# EAGLE design SidBerry_AriettaG25 (EAGLE 7.1.0)
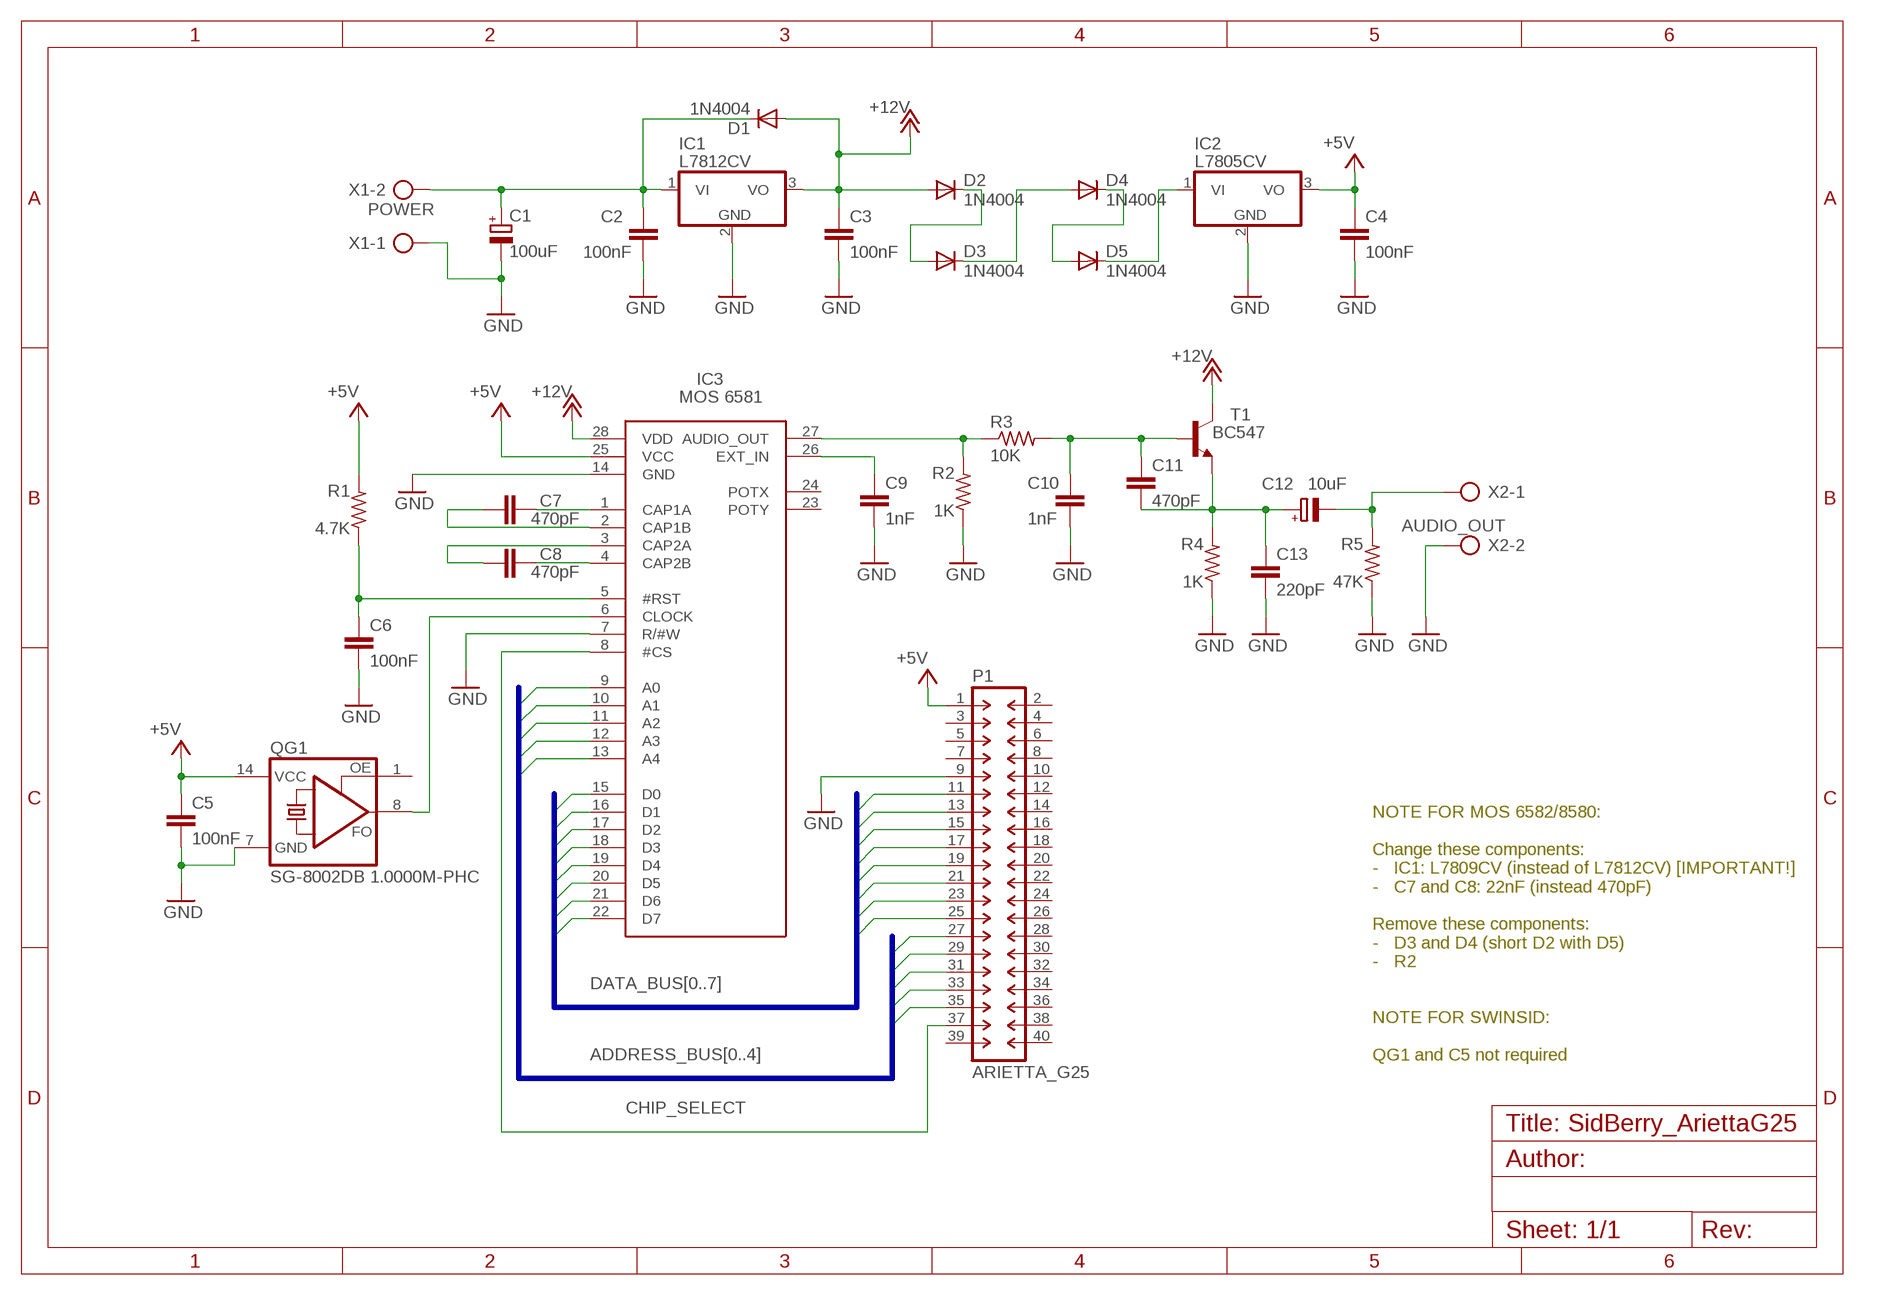
[diagram p0: schematic, sheet 1]
FRAME1 (A4L-LOC): AUTHOR: Alessio Lombardo; REV: 1

## Parts
C1  100uF  CPOL-EUE2.5-6  [E2,5-6]
C2  100nF  C-EU025-024X044  [C025-024X044]
C3  100nF  C-EU025-024X044  [C025-024X044]
C4  100nF  C-EU025-024X044  [C025-024X044]
C5  100nF  C-EU025-024X044  [C025-024X044]
C6  100nF  C-EU025-024X044  [C025-024X044]
C7  470pF  C-EU025-024X044  [C025-024X044]
C8  470pF  C-EU025-024X044  [C025-024X044]
C9  1nF  C-EU025-024X044  [C025-024X044]
C10  1nF  C-EU025-024X044  [C025-024X044]
C11  470pF  C-EU025-024X044  [C025-024X044]
C12  10uF  CPOL-EUE2.5-5  [E2,5-5]
C13  220pF  C-EU025-024X044  [C025-024X044]
D1  1N4004  [DO41-10]
D2  1N4004  [DO41-10]
D3  1N4004  [DO41-10]
D4  1N4004  [DO41-10]
D5  1N4004  [DO41-10]
IC1  L7812CV  7812TV  [TO220V]
IC2  L7805CV  7805TV  [TO220V]
IC3  MOS 6581  SID_6581  [DIL28-6]
P1  ARIETTA_G25  M-2X20-DIL-100  [DIL-100-2X20]
QG1  SG-8002DB 1.0000M-PHC  SG51  [SG51]
R1  4.7K  R-US_0207/10  [0207/10]
R2  1K  R-US_0207/10  [0207/10]
R3  10K  R-US_0207/10  [0207/10]
R4  1K  R-US_0207/10  [0207/10]
R5  47K  R-US_0207/10  [0207/10]
T1  BC547  BC547-NPN-TO92-CBE  [TO92-CBE]
X1  POWER  AK500/2  [AK500/2]
X2  AUDIO_OUT  AK500/2  [AK500/2]

## Nets
+5V: C4.1 C5.1 IC2.3(VO) IC3.25(VCC) P1.1 QG1.14(VCC) R1.2
+12V: C3.1 D1.A D2.A IC1.3(VO) IC3.28(VDD) T1.C
ADDRESS_BUS0: IC3.9(A0) P1.27
ADDRESS_BUS1: IC3.10(A1) P1.29
ADDRESS_BUS2: IC3.11(A2) P1.31
ADDRESS_BUS3: IC3.12(A3) P1.33
ADDRESS_BUS4: IC3.13(A4) P1.35
CHIP_SELECT: IC3.8(#CS) P1.37
DATA_BUS0: IC3.15(D0) P1.25
DATA_BUS1: IC3.16(D1) P1.23
DATA_BUS2: IC3.17(D2) P1.21
DATA_BUS3: IC3.18(D3) P1.19
DATA_BUS4: IC3.19(D4) P1.17
DATA_BUS5: IC3.20(D5) P1.15
DATA_BUS6: IC3.21(D6) P1.13
DATA_BUS7: IC3.22(D7) P1.11
GND: C1.- C2.2 C3.2 C4.2 C5.2 C6.2 C9.2 C10.2 C13.2 IC1.2(GND) IC2.2(GND) IC3.7(R/#W) IC3.14(GND) P1.9 QG1.7(GND) R2.1 R4.1 R5.1 X1.1 X2.2
N$1: IC3.6(CLOCK) QG1.8(FO)
N$2: C9.1 IC3.26(EXT_IN)
N$3: D2.C D3.A
N$4: D3.C D4.A
N$5: D4.C D5.A
N$6: D5.C IC2.1(VI)
N$7: C8.2 IC3.4(CAP2B)
N$8: C8.1 IC3.3(CAP2A)
N$9: C7.1 IC3.2(CAP1B)
N$10: C7.2 IC3.1(CAP1A)
N$11: C6.1 IC3.5(#RST) R1.1
N$12: IC3.27(AUDIO_OUT) R2.2 R3.1
N$13: C1.+ C2.1 D1.C IC1.1(VI) X1.2
N$14: C12.- R5.2 X2.1
N$15: C10.1 C11.1 R3.2 T1.B
N$16: C11.2 C12.+ C13.1 R4.2 T1.E
Unconnected: IC3.23(POTY) IC3.24(POTX) P1.2 P1.3 P1.4 P1.5 P1.6 P1.7 P1.8 P1.10 P1.12 P1.14 P1.16 P1.18 P1.20 P1.22 P1.24 P1.26 P1.28 P1.30 P1.32 P1.34 P1.36 P1.38 P1.39 P1.40 QG1.1(OE)

## Buses
ADDRESS_BUS[0..4]
DATA_BUS[0..7]

## Notes on the sheet
- NOTE FOR MOS 6582/8580:
  
  Change these components:
  -   IC1: L7809CV (instead of L7812CV) [IMPORTANT!]
  -   C7 and C8: 22nF (instead 470pF)
  
  Remove these components:
  -   D3 and D4 (short D2 with D5)
  -   R2
  
  
  NOTE FOR SWINSID:
  
  QG1 and C5 not required

## Library data of the parts
C1 C12 = rcl:CPOL-EU: POLARIZED CAPACITOR, European symbol
C2-C11 C13 = rcl:C-EU: CAPACITOR, European symbol
D1-D5 = _mod_diode:1N4004: DIODE general purpose rectifier, 1 A
IC1 IC2 = linear:78*: Positive VOLTAGE REGULATOR Source: http://cache.national.com/ds/LM/LM78L05.pdf http://www.fairchildsemi.com/ds/LM/LM7805.pdf
IC3 = 6581-sid:SID_6581
P1 = con-headers-jp:M-2X20-: MALE HEADER
QG1 = crystal:SG51: CRYSTAL RESONATOR; OC_FARNELL: unknown; OC_NEWARK: unknown
R1-R5 = rcl:R-US_: RESISTOR, American symbol
T1 = transistor:*-NPN-: NPN Transistror BF959 corrected 2008.03.06
X1 X2 = con-ptr500:AK500/2: CONNECTOR; OC_FARNELL: unknown; OC_NEWARK: unknown

## Board
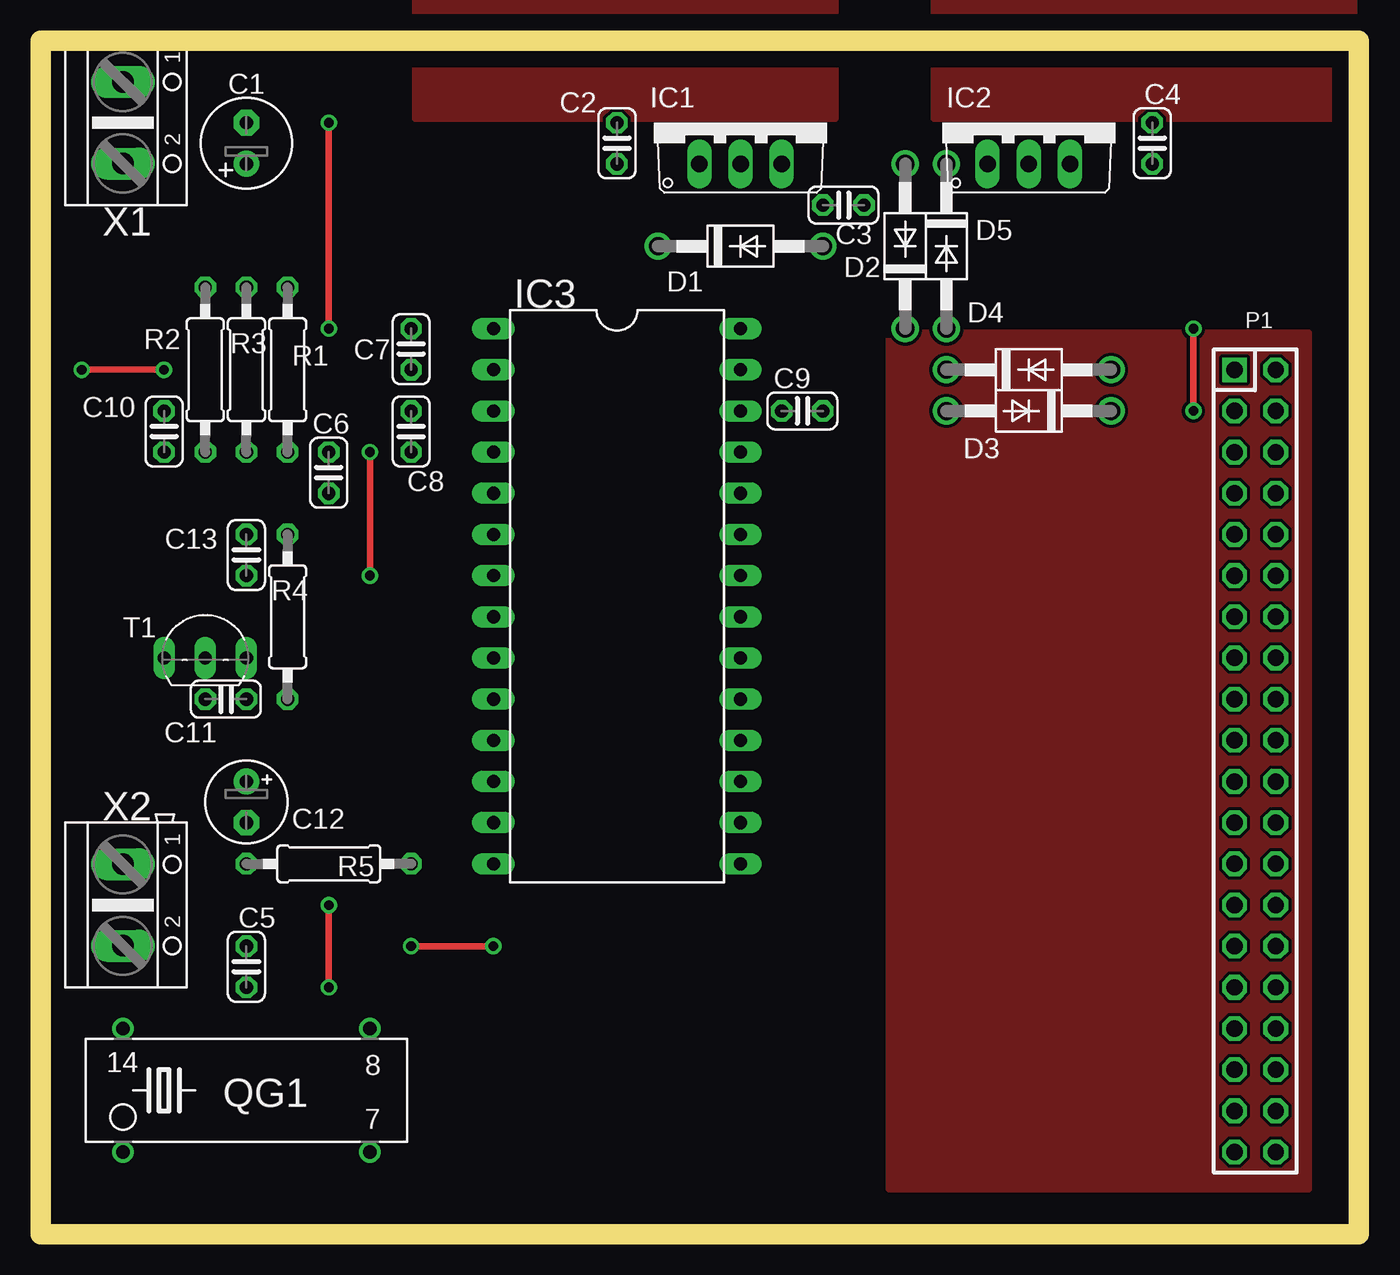
[diagram p1: board, top side]
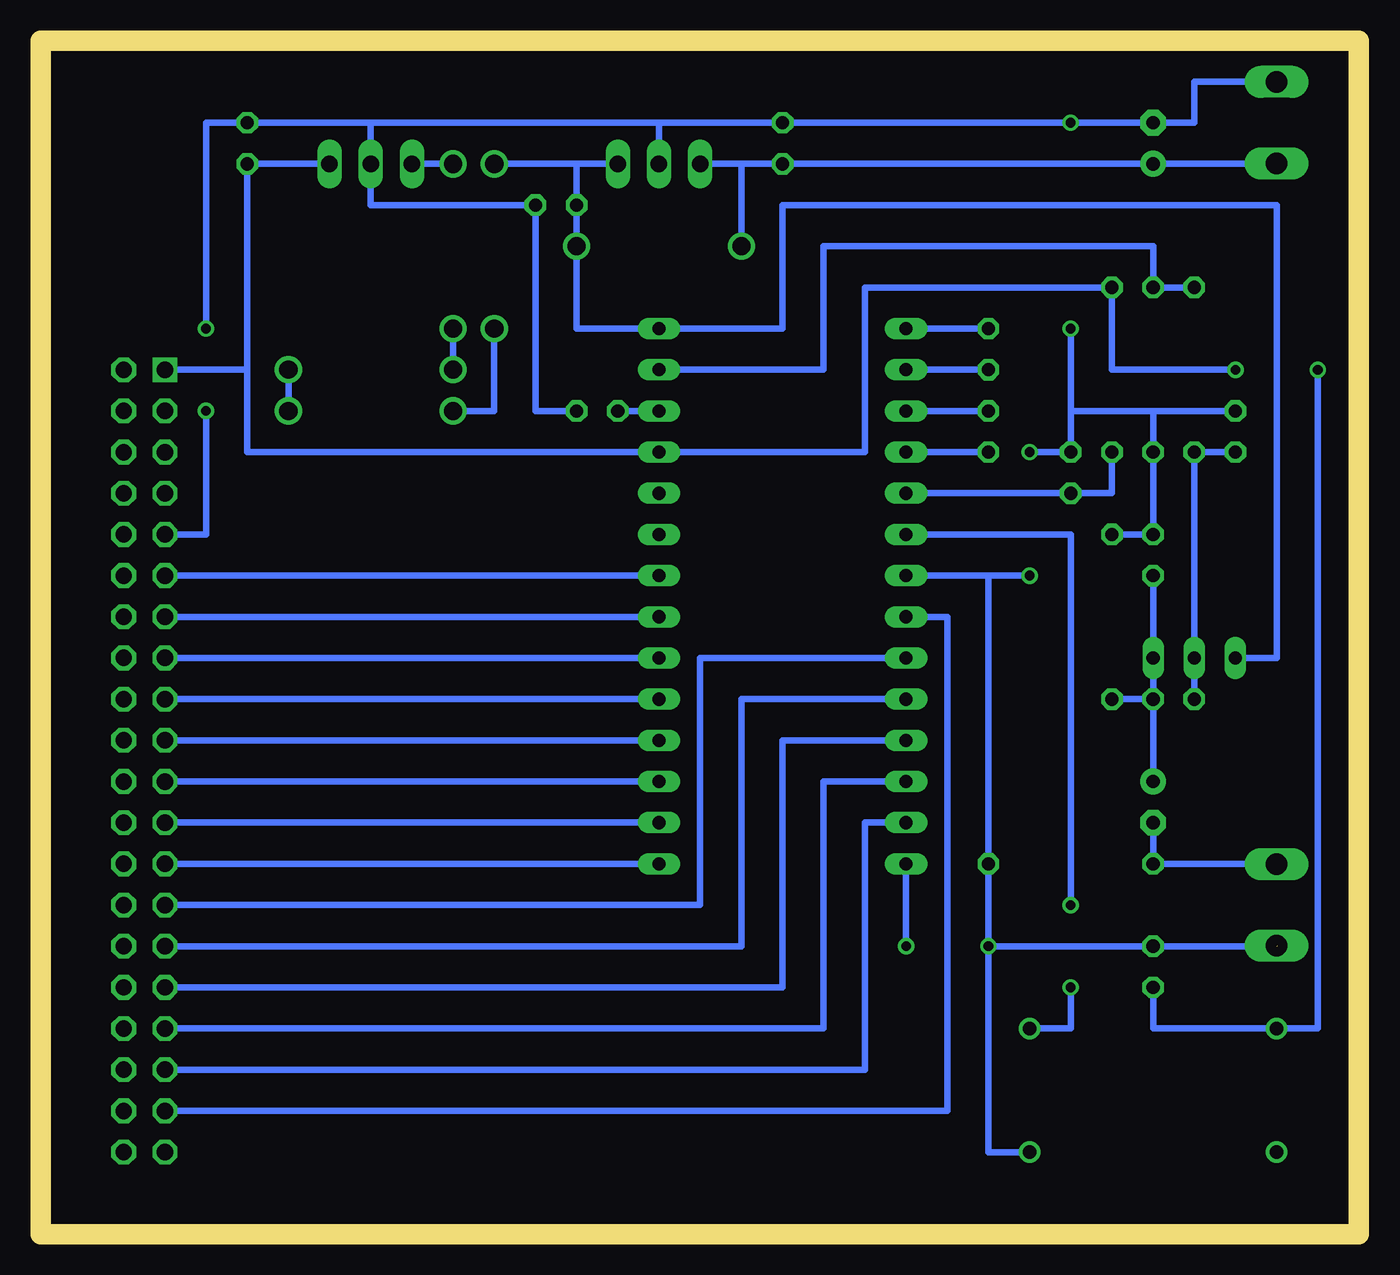
[diagram p2: board, bottom side, seen from below]

Size 81.33 x 73.65 mm. Coordinates in mm from the lower left corner, seen from the top.
Outline: 0,0 81.33,0 81.33,73.65 0,73.65 0,0
Copper layers (1*16): Top 0.035mm / dielectric 1.5mm / Bottom 0.035mm
Design rules "default": minimum track width 10mil, minimum drill 24mil, track to track 8mil, track to pad 8mil, pad to pad 8mil, via to via 8mil, smd to smd 8mil, copper to edge 40mil, drill to drill 8mil, minimum pad ring 10mil, minimum via ring 8mil, stop-mask expansion 4mil, vias tented up to drill 0mil, thermal gap 10mil

### Footprints (pad centres in the part's own frame; a part is rotated, then mirrored left to right if it is on the bottom)
E2,5-6 = drill 0.813 pad 1.6: + -1.27,0 | drill 0.813 pad 1.6 octagon: - 1.27,0
C025-024X044 = drill 0.813 octagon: 1 -1.27,0; 2 1.27,0
E2,5-5 = drill 0.813 pad 1.6: + -1.27,0 | drill 0.813 pad 1.6 octagon: - 1.27,0
DO41-10 = drill 1.118: A 5.08,0; C -5.08,0
TO220V = drill 1.016 long: 1 -2.54,-2.54; 2 0,-2.54; 3 2.54,-2.54
DIL28-6 = drill 0.813 long: 1 -16.51,-7.62; 2 -13.97,-7.62; 3 -11.43,-7.62; 4 -8.89,-7.62; 5 -6.35,-7.62; 6 -3.81,-7.62; 7 -1.27,-7.62; 8 1.27,-7.62; 9 3.81,-7.62; 10 6.35,-7.62; 11 8.89,-7.62; 12 11.43,-7.62; 13 13.97,-7.62; 14 16.51,-7.62; 15 16.51,7.62; 16 13.97,7.62; 17 11.43,7.62; 18 8.89,7.62; 19 6.35,7.62; 20 3.81,7.62; 21 1.27,7.62; 22 -1.27,7.62; 23 -3.81,7.62; 24 -6.35,7.62; 25 -8.89,7.62; 26 -11.43,7.62; 27 -13.97,7.62; 28 -16.51,7.62
DIL-100-2X20 = drill 1.016 square: 1 -24.13,-1.27 | drill 1.016 octagon: 2 -24.13,1.27; 3 -21.59,-1.27; 4 -21.59,1.27; 5 -19.05,-1.27; 6 -19.05,1.27; 7 -16.51,-1.27; 8 -16.51,1.27; 9 -13.97,-1.27; 10 -13.97,1.27; 11 -11.43,-1.27; 12 -11.43,1.27; 13 -8.89,-1.27; 14 -8.89,1.27; 15 -6.35,-1.27; 16 -6.35,1.27; 17 -3.81,-1.27; 18 -3.81,1.27; 19 -1.27,-1.27; 20 -1.27,1.27; 21 1.27,-1.27; 22 1.27,1.27; 23 3.81,-1.27; 24 3.81,1.27; 25 6.35,-1.27; 26 6.35,1.27; 27 8.89,-1.27; 28 8.89,1.27; 29 11.43,-1.27; 30 11.43,1.27; 31 13.97,-1.27; 32 13.97,1.27; 33 16.51,-1.27; 34 16.51,1.27; 35 19.05,-1.27; 36 19.05,1.27; 37 21.59,-1.27; 38 21.59,1.27; 39 24.13,-1.27; 40 24.13,1.27
SG51 = drill 0.813: 1 -7.62,-3.81; 7 7.62,-3.81; 8 7.62,3.81; 14 -7.62,3.81
0207/10 = drill 0.813 octagon: 1 -5.08,0; 2 5.08,0
TO92-CBE = drill 0.813 long: B 0,0; C -2.54,0; E 2.54,0
AK500/2 = drill 1.321 long: 1 -2.515,0; 2 2.515,0

### Placement (x,y rotation side)
C1  12.7,67.31 90 top
C2  35.56,67.31 90 top
C3  49.53,63.5 0 top
C4  68.58,67.31 90 top
C5  12.7,16.51 90 top
C6  17.78,46.99 90 top
C7  22.86,54.61 90 top
C8  22.86,49.53 270 top
C9  46.99,50.8 0 top
C10  7.62,49.53 90 top
C11  11.43,33.02 0 top
C12  12.7,26.67 270 top
C13  12.7,41.91 90 top
D1  43.18,60.96 0 top
D2  53.34,60.96 90 top
D3  60.96,50.8 180 top
D4  60.96,53.34 0 top
D5  55.88,60.96 270 top
IC1  43.18,68.58 0 top
IC2  60.96,68.58 0 top
IC3  35.56,39.37 270 top
P1  74.93,29.21 270 top
QG1  12.7,8.89 0 top
R1  15.24,53.34 90 top
R2  12.7,53.34 90 top
R3  10.16,53.34 270 top
R4  15.24,38.1 270 top
R5  17.78,22.86 180 top
T1  10.16,35.56 0 top
U$1  [A4L-LOC]  -83.31,-43.43 0 top  (outside the outline)
X1  5.08,68.58 270 top
X2  5.08,20.32 270 top

### Tracks (layer width: path | path; a pad name or v marks a point on that pad's centre or on a via)
+5V  (via drill 0.6)
  Top 0.406: 2.54,53.34 v7.62,53.34
  Bottom 0.406: P1.1 68.58,53.34 | 68.58,53.34 C4.1 IC2.3 | 68.58,53.34 68.58,48.26 IC3.25 30.48,48.26 30.48,58.42 R1.2 15.24,53.34 v7.62,53.34 | C5.1 12.7,12.7 QG1.14 2.54,12.7 2.54,53.34
+12V
  Bottom 0.406: T1.C 5.08,35.56 5.08,63.5 35.56,63.5 35.56,55.88 IC3.28 48.26,55.88 D1.A C3.1 48.26,66.04 | IC1.3 48.26,66.04 | 48.26,66.04 D2.A
ADDRESS_BUS0
  Bottom 0.406: P1.27 40.64,20.32 40.64,35.56 IC3.9
ADDRESS_BUS1
  Bottom 0.406: P1.29 38.1,17.78 38.1,33.02 IC3.10
ADDRESS_BUS2
  Bottom 0.406: P1.31 35.56,15.24 35.56,30.48 IC3.11
ADDRESS_BUS3
  Bottom 0.406: P1.33 33.02,12.7 33.02,27.94 IC3.12
ADDRESS_BUS4
  Bottom 0.406: P1.35 30.48,10.16 30.48,25.4 IC3.13
CHIP_SELECT
  Bottom 0.406: IC3.8 25.4,38.1 25.4,7.62 P1.37
DATA_BUS0
  Bottom 0.406: P1.25 IC3.15
DATA_BUS1
  Bottom 0.406: IC3.16 P1.23
DATA_BUS2
  Bottom 0.406: P1.21 IC3.17
DATA_BUS3
  Bottom 0.406: IC3.18 P1.19
DATA_BUS4
  Bottom 0.406: P1.17 IC3.19
DATA_BUS5
  Bottom 0.406: IC3.20 P1.15
DATA_BUS6
  Bottom 0.406: P1.13 IC3.21
DATA_BUS7
  Bottom 0.406: IC3.22 P1.11
GND  (via drill 0.6)  (1 unrouted)
  Top 0.406: v71.12,50.8 v71.12,55.88 | v27.94,17.78 v22.86,17.78 | v17.78,68.58 v17.78,55.88 | v20.32,40.64 20.32,48.26
  Bottom 0.406: 43.18,68.58 C2.2 v17.78,68.58 C1.- 10.16,68.58 10.16,71.12 5.08,71.12 X1.1 | 43.18,68.58 IC1.2 | 60.96,68.58 IC2.2 60.96,63.5 C3.2 50.8,50.8 C9.2 | 60.96,68.58 43.18,68.58 | 60.96,68.58 C4.2 71.12,68.58 v71.12,55.88 | P1.9 71.12,43.18 v71.12,50.8 | v27.94,17.78 IC3.14 | v22.86,17.78 C5.2 5.08,17.78 | QG1.7 22.86,5.08 v22.86,17.78 | IC3.7 22.86,40.64 | 22.86,40.64 R5.1 v22.86,17.78 | C10.2 12.7,50.8 | 12.7,50.8 R2.1 C13.2 R4.1 | C6.2 17.78,50.8 12.7,50.8 | C6.2 v17.78,55.88 | 22.86,40.64 v20.32,40.64 | 20.32,48.26 C6.2
N$1
  Top 0.406: 17.78,15.24 17.78,20.32
  Bottom 0.406: QG1.8 17.78,12.7 17.78,15.24 | 17.78,20.32 17.78,43.18 IC3.6
N$2
  Bottom 0.406: C9.1 IC3.26
N$3
  Bottom 0.406: D3.A 53.34,50.8 D2.C
N$4
  Bottom 0.406: D4.A D3.C
N$5
  Bottom 0.406: D5.A D4.C
N$6
  Bottom 0.406: D5.C IC2.1
N$7
  Bottom 0.406: C8.2 IC3.4
N$8
  Bottom 0.406: C8.1 IC3.3
N$9
  Bottom 0.406: C7.1 IC3.2
N$10
  Bottom 0.406: C7.2 IC3.1
N$11
  Bottom 0.406: R1.1 15.24,45.72 C6.1 IC3.5
N$12
  Bottom 0.406: IC3.27 33.02,53.34 33.02,60.96 12.7,60.96 R2.2 R3.1
N$13
  Bottom 0.406: 38.1,66.04 C2.1 C1.+ 12.7,66.06 X1.2 | D1.C 38.1,66.04 | IC1.1 38.1,66.04
N$14
  Bottom 0.406: X2.1 5.08,22.86 R5.2 C12.-
N$15
  Bottom 0.406: C10.1 R3.2 T1.B C11.1
N$16
  Bottom 0.406: C12.+ C11.2 | R4.2 C11.2 | C13.1 T1.E C11.2
N$17  (via drill 0.6)
  other vias: 17.78,20.32
N$18  (via drill 0.6)
  other vias: 17.78,15.24
N$20  (via drill 0.6)
  other vias: 20.32,48.26
N$21  (via drill 0.6)
  other vias: 2.54,53.34
N$22
  pour Top: 55.12,93.73 81.03,93.73 81.03,68.83 55.12,68.83
  pour Top: 23.11,93.73 49.02,93.73 49.02,68.83 23.11,68.83
  pour Top: 52.32,55.63 78.23,55.63 78.23,2.79 52.32,2.79

### Text on the board
Top: NOTE FOR MOS 6582/8580: / / Change these components: / - IC1: L7809CV (instead of L7812CV) [IMPORTANT!] / - C7 and C8: 22nF (instead 470pF) / / Remove these components: / - D3 and D4 (short D2 with D5) / - R2 / / / NOTE FOR SWINSID: / / QG1 and C5 not required